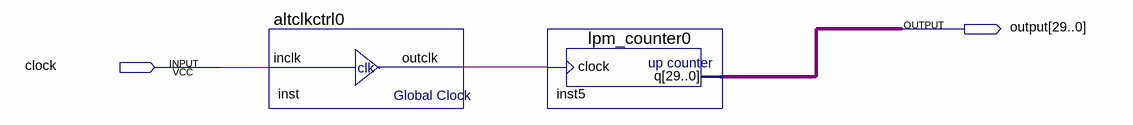
[diagram p0: schematic sheet]
// Quartus schematic blinkenlights.bdf as structural Verilog: 2 symbols, 2 pins
module blinkenlights (
  input  clock,
  output [29:0] \output 
);

  wire inst_outclk;

  altclkctrl0 inst (.inclk(clock), .outclk(inst_outclk));
  lpm_counter0 inst5 (.clock(inst_outclk), .q(\output ));
endmodule
